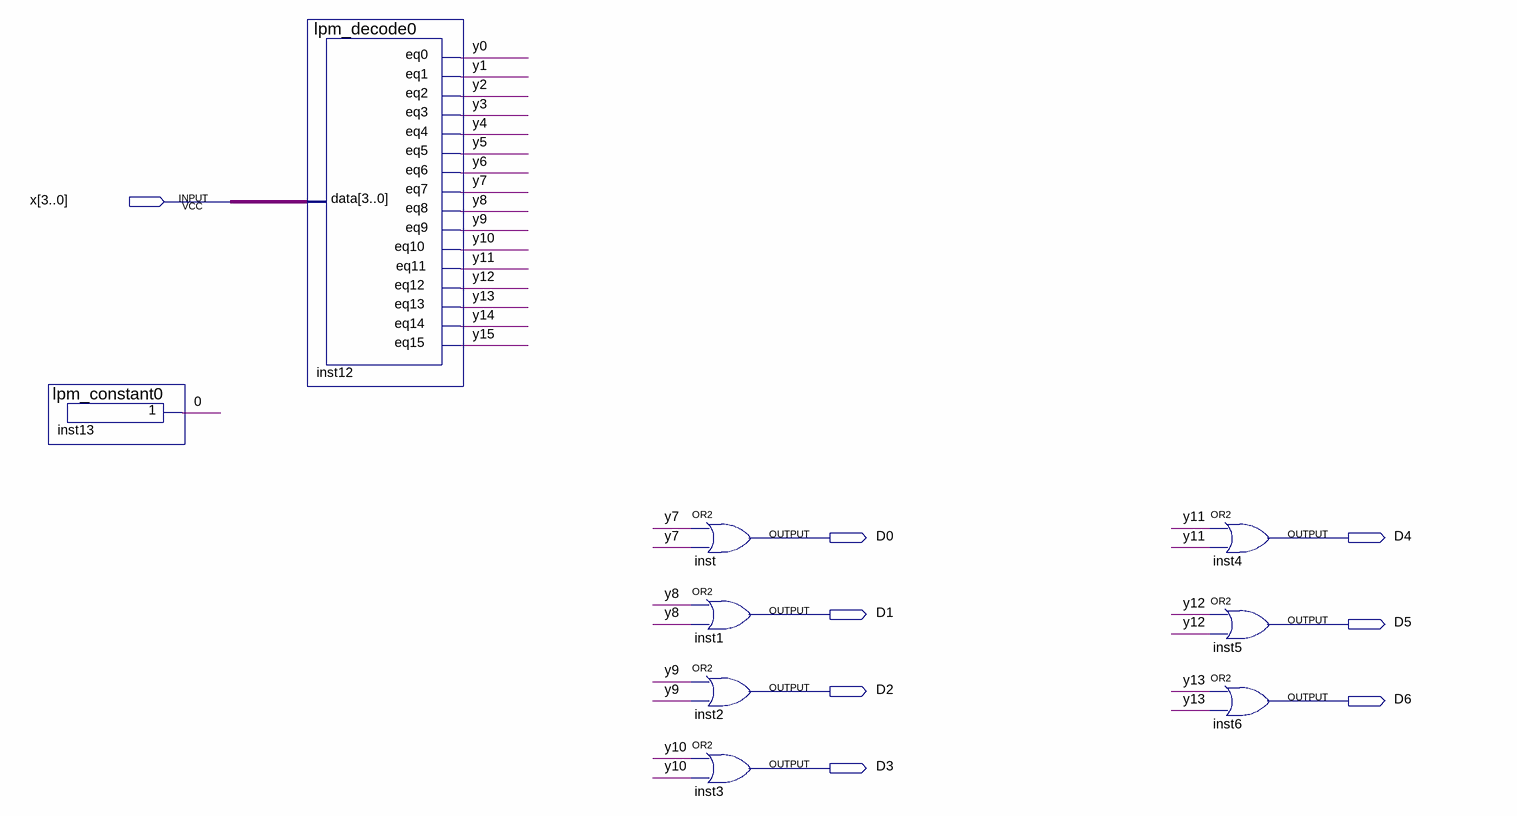
[diagram p0: schematic sheet]
// Quartus schematic 2_2.bdf as structural Verilog: 9 symbols, 8 pins
module \2_2  (
  input  [3:0] x,
  output D0,
  output D4,
  output D1,
  output D5,
  output D2,
  output D6,
  output D3
);

  wire \0 , y0, y1, y2, y3, y4, y5, y6, y7, y8, y9, y10, y11, y12, y13, y14, y15;

  lpm_constant0 inst13 (.result(\0 ));
  lpm_decode0 inst12 (
    .data(x), .eq0(y0), .eq1(y1), .eq2(y2), .eq3(y3), .eq4(y4), .eq5(y5), .eq6(y6), .eq7(y7), .eq8(y8),
    .eq9(y9), .eq10(y10), .eq11(y11), .eq12(y12), .eq13(y13), .eq14(y14), .eq15(y15));
  or inst (D0, y7, y7);
  or inst1 (D1, y8, y8);
  or inst2 (D2, y9, y9);
  or inst3 (D3, y10, y10);
  or inst4 (D4, y11, y11);
  or inst5 (D5, y12, y12);
  or inst6 (D6, y13, y13);
endmodule
